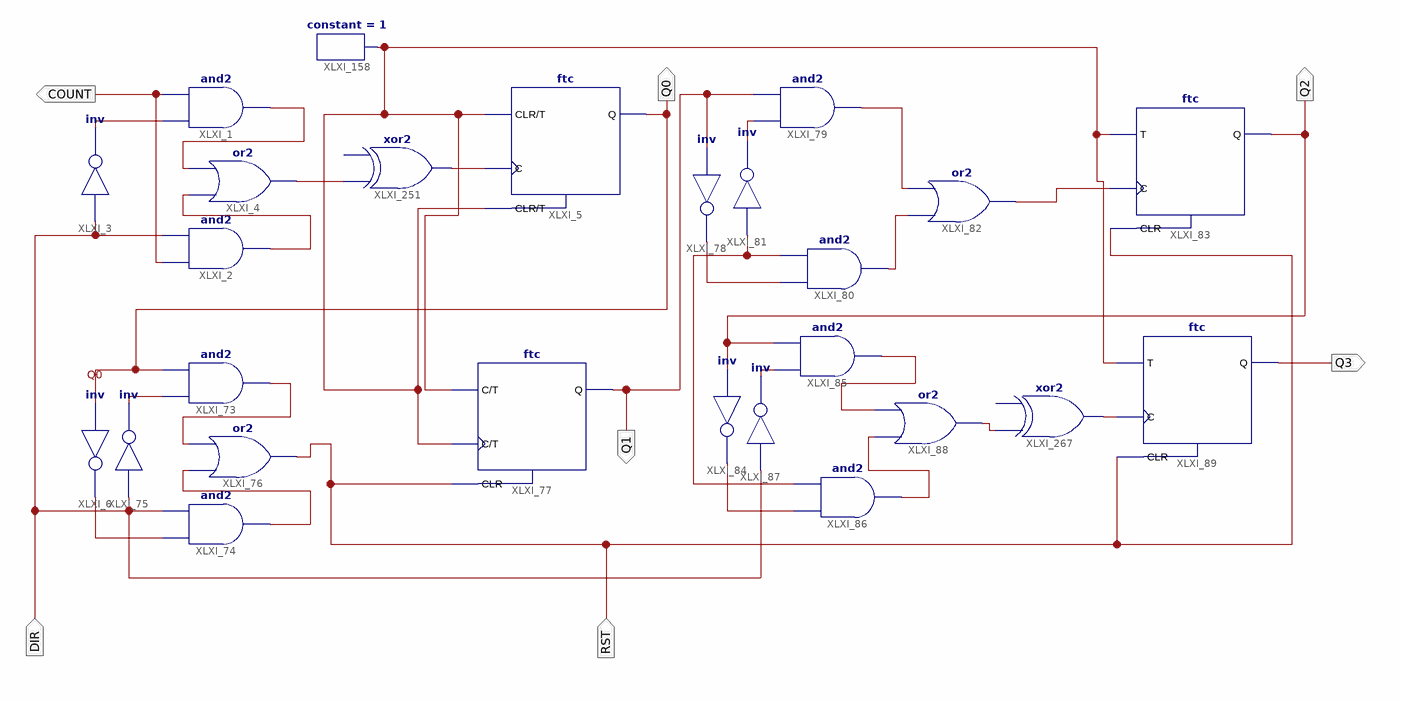
[diagram p0: schematic sheet 1]
// Xilinx ISE schematic count_bidir_4.sch (spartan6) as structural Verilog: 26 symbols, 8 ports
module count_bidir_4 (
  input  XLXN_101,
  input  DIR,
  input  RST,
  output Q0,
  output COUNT,
  output Q3,
  output Q1,
  output Q2
);

  wire XLXN_65, XLXN_68, XLXN_97, XLXN_105, XLXN_107, XLXN_108, XLXN_109, XLXN_113, XLXN_115, XLXN_116,
       XLXN_186, XLXN_197, XLXN_216, XLXN_429, XLXN_430, XLXN_431, XLXN_432, XLXN_470, XLXN_493, XLXN_496,
       XLXN_497;

  not XLXI_3 (XLXN_65, DIR);
  and XLXI_1 (XLXN_429, XLXN_65, COUNT);
  and XLXI_2 (XLXN_430, COUNT, DIR);
  or XLXI_4 (XLXN_470, XLXN_430, XLXN_429);
  and XLXI_73 (XLXN_431, XLXN_97, Q0);
  and XLXI_74 (XLXN_432, XLXN_186, DIR);
  not XLXI_75 (XLXN_97, DIR);
  or XLXI_76 (RST, XLXN_432, XLXN_431);
  not XLXI_6 (XLXN_186, Q0);
  buf XLXI_251 (XLXN_68, XLXN_470);  // xor2 open: I1
  constant #(.CValue("1")) XLXI_158 (.O(XLXN_109));
  not XLXI_84 (XLXN_216, Q2);
  ftc XLXI_89 (.C(XLXN_496), .CLR(RST), .T(XLXN_109), .Q(Q3));
  or XLXI_88 (XLXN_497, XLXN_116, XLXN_115);
  not XLXI_87 (XLXN_113, DIR);
  and XLXI_86 (XLXN_116, XLXN_216, DIR);
  and XLXI_85 (XLXN_115, XLXN_113, Q2);
  not XLXI_78 (XLXN_197, Q1);
  ftc XLXI_83 (.C(XLXN_493), .CLR(RST), .T(XLXN_109), .Q(Q2));
  or XLXI_82 (XLXN_493, XLXN_108, XLXN_107);
  not XLXI_81 (XLXN_105, DIR);
  and XLXI_80 (XLXN_108, XLXN_197, DIR);
  and XLXI_79 (XLXN_107, XLXN_105, Q1);
  ftc XLXI_77 (.C(XLXN_109), .CLR(RST), .T(XLXN_109), .Q(Q1));
  ftc XLXI_5 (.C(XLXN_68), .CLR(XLXN_109), .T(XLXN_109), .Q(Q0));
  buf XLXI_267 (XLXN_496, XLXN_497);  // xor2 open: I1
endmodule
